# EAGLE design avoccado-nora-test-jig (EAGLE 7.2.0)
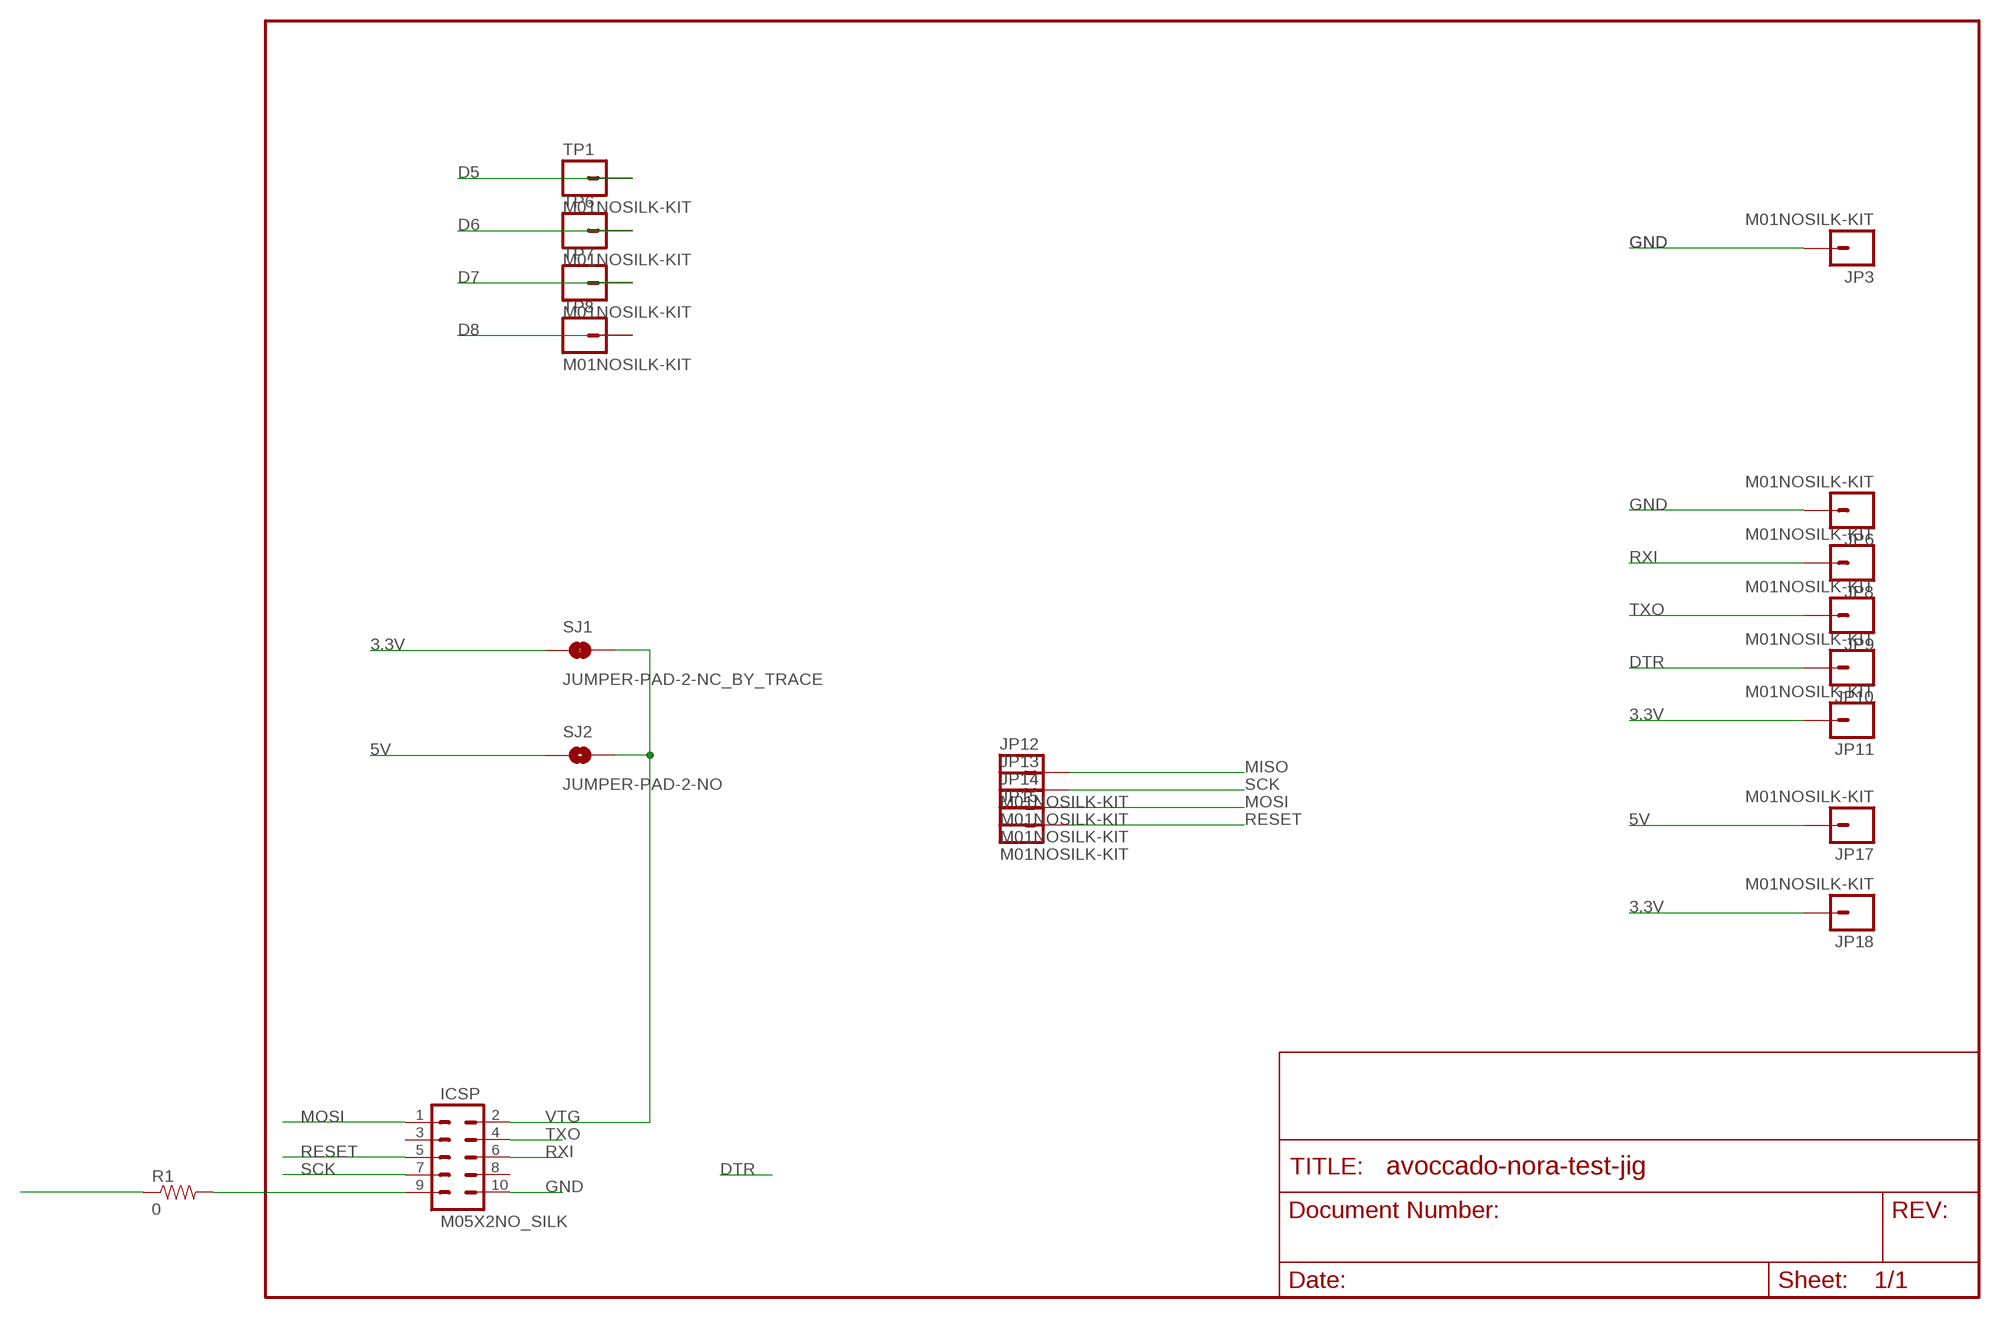
[diagram p0: schematic, sheet 1]

## Parts
ICSP  M05X2NO_SILK  [2X5_NOSILK]
JP3  M01NOSILK-KIT  [1X01NS-KIT]
JP6  M01NOSILK-KIT  [1X01NS-KIT]
JP8  M01NOSILK-KIT  [1X01NS-KIT]
JP9  M01NOSILK-KIT  [1X01NS-KIT]
JP10  M01NOSILK-KIT  [1X01NS-KIT]
JP11  M01NOSILK-KIT  [1X01NS-KIT]
JP12  M01NOSILK-KIT  [1X01NS-KIT]
JP13  M01NOSILK-KIT  [1X01NS-KIT]
JP14  M01NOSILK-KIT  [1X01NS-KIT]
JP15  M01NOSILK-KIT  [1X01NS-KIT]
JP17  M01NOSILK-KIT  [1X01NS-KIT]
JP18  M01NOSILK-KIT  [1X01NS-KIT]
R1  0  RESISTOR1206  [1206]
SJ1  JUMPER-PAD-2-NC_BY_TRACE  [PAD-JUMPER-2-NC_BY_TRACE_YES_SILK]
SJ2  JUMPER-PAD-2-NO  [PAD-JUMPER-2-NO_NO_SILK]
TP1  M01NOSILK-KIT  [1X01NS-KIT]
TP6  M01NOSILK-KIT  [1X01NS-KIT]
TP7  M01NOSILK-KIT  [1X01NS-KIT]
TP8  M01NOSILK-KIT  [1X01NS-KIT]

## Nets
3.3V: JP11.1 JP18.1 SJ1.1
5V: JP17.1 SJ2.1
D5: TP1.1
D6: TP6.1
D7: TP7.1
D8: TP8.1
DTR: JP10.1
GND [vcc]: ICSP.10 JP3.1 JP6.1
MISO: JP12.1 R1.1
MISO1: ICSP.9 R1.2
MOSI: ICSP.1 JP14.1
RESET: ICSP.5 JP15.1
RXI: ICSP.6 JP8.1
SCK: ICSP.7 JP13.1
TXO: ICSP.4 JP9.1
VTG: ICSP.2 SJ1.2 SJ2.2
Unconnected: ICSP.3 ICSP.8

## Library data of the parts
ICSP = SparkFun-Connectors:M05X2: Header 5x2 Standard 10-pin dual row 0.1" header. Commonly used with AVR-ISP. Use with Spark Fun Electronics SKU: PRT-00778
JP3 JP6 JP8-JP15 JP17 JP18 TP1 TP6-TP8 = SparkFun-Connectors:M01: Header 1 Standard 1-pin 0.1" header. Use with straight break away headers (SKU : PRT-00116), right angle break away headers (PRT-00553), swiss pins (PRT-00743), machine pins (PRT-00117), and female headers (PRT-00115).
R1 = SparkFun-Passives:RESISTOR: Resistor Basic schematic elements and footprints for 0603, 1206, and PTH resistors.
SJ1 = SparkFun-Passives:JUMPER-PAD-2-NC_BY_TRACE
SJ2 = SparkFun-Passives:JUMPER-PAD-2-NO

## Net classes
1 vcc: width 0.254 mm
3 usbvcc: width 0.203 mm, drill 0.61 mm, clearance 0.152 mm

## Board
Avoccado-avr-yolandi Yolandi is the minified version of Avoccado-avr with less pins broken out and a footprint of less than one square inch for the PCB without peripherals.
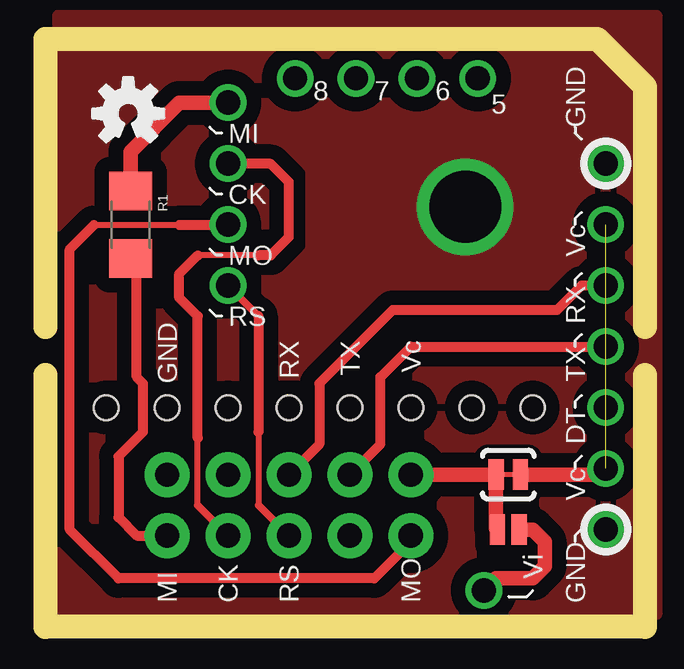
[diagram p1: board, top side]
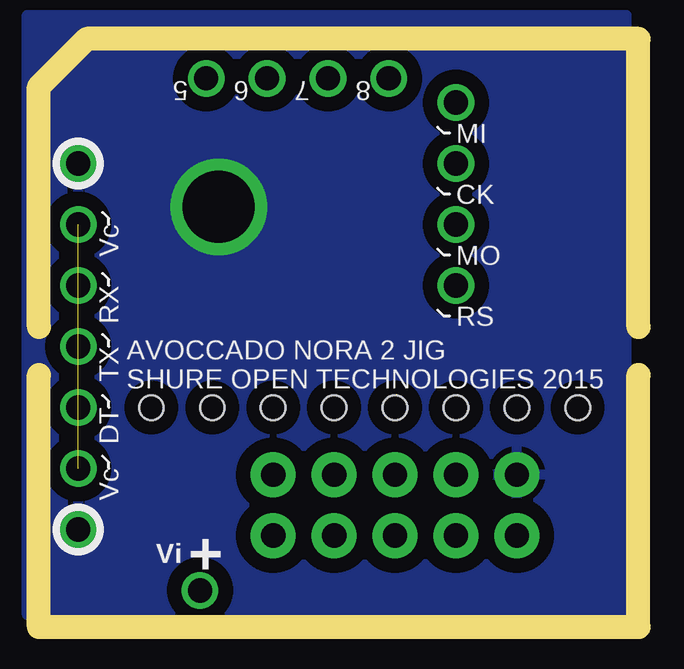
[diagram p2: board, bottom side, seen from below]

No outline drawn. Coordinates in mm, seen from the top.
Copper layers (1*16): Top 0.035mm / dielectric 1.5mm / Bottom 0.035mm
Design rules "dirt_cheap_dirty_boards.v1 *": minimum track width 5mil, minimum drill 12mil, track to track 5mil, track to pad 5mil, pad to pad 5mil, via to via 5mil, smd to smd 0mil, copper to edge 10mil, drill to drill 10mil, minimum pad ring 10mil, minimum via ring 6mil, stop-mask expansion 0mil, vias tented up to drill 25mil, thermal gap 10mil
Holes 1.02 mm at 4.57,8.64 7.11,8.64 9.65,8.64 12.19,8.64 14.73,8.64 17.27,8.64 19.81,8.64 2.03,8.64
tRestrict: area 3,3 to 14.7,7.1
Milling: 7 lines

### Footprints (pad centres in the part's own frame; a part is rotated, then mirrored left to right if it is on the bottom)
2X5_NOSILK = drill 1.016 pad 1.88: 1 -1.27,5.08; 2 1.27,5.08; 3 -1.27,2.54; 4 1.27,2.54; 5 -1.27,0; 6 1.27,0; 7 -1.27,-2.54; 8 1.27,-2.54; 9 -1.27,-5.08; 10 1.27,-5.08
1X01NS-KIT = drill 1.016 pad 1.524: 1 0,0
1206 = smd 1.6 x 1.8: 1 -1.4,0; 2 1.4,0
PAD-JUMPER-2-NC_BY_TRACE_YES_SILK = smd 0.635 x 1.27: 1 -0.508,0; 2 0.508,0
PAD-JUMPER-2-NO_NO_SILK = smd 0.635 x 1.27: 1 -0.45,0; 2 0.45,0

### Placement (x,y rotation side)
ICSP  9.65,4.57 90 bottom
JP3  22.86,18.8 0 top
JP6  22.86,3.56 0 top
JP8  22.86,13.72 0 top
JP9  22.86,11.18 0 top
JP10  22.86,8.64 0 top
JP11  22.86,16.26 0 top
JP12  7.11,21.34 0 top
JP13  7.11,18.8 0 top
JP14  7.11,16.26 0 top
JP15  7.11,13.72 0 top
JP17  17.78,1.02 0 top
JP18  22.86,6.1 0 top
LOGO2  OSHW-LOGOS  [OSHW-LOGO-S]  2.95,20.89 0 top
R1  3.05,16.26 270 top
SJ1  18.8,5.84 180 top
SJ2  18.8,3.56 180 top
TP1  17.53,22.36 270 top
TP6  14.99,22.36 270 top
TP7  12.45,22.36 270 top
TP8  9.91,22.36 270 top

### Tracks (layer width: path | path; a pad name or v marks a point on that pad's centre or on a via)
3.3V  (1 unrouted)
  Top 0.61: SJ1.1 22.6,5.84 JP18.1
5V
  Top 0.61: SJ2.1 19.81,3.56 20.32,3.05 20.32,2.03 19.81,1.52 18.28,1.52 JP17.1
GND  (via drill 3 pad 4)
  other vias: 17,17
  pour Bottom (isolate 0.61): 0.4,23.02 21,23 22.5,21.5 22.5,1 0.4,1
  pour Top (isolate 0.61): 0,0 0,25 25,25 25,0
  pour Top: 10.41,13.21 10.41,20.83 14.73,20.83 14.73,13.97 13.72,13.97 12.7,13.21
  pour Bottom (isolate 0.61): 25,0 25,25 0,25 0,0
MISO
  Top 0.61: R1.1 3.05,19.3 5.08,21.34 JP12.1
MISO1
  Top 0.305: 3.3,14.6 R1.2
  Top 0.406: ICSP.9 3.3,3.3 2.54,4.06 2.54,6.6 3.56,7.62 3.56,9.65 3.3,9.91 3.3,14.6
MOSI
  Top 0.254: 1.52,16.26 5.08,16.26
  Top 0.406: ICSP.1 14.73,3.05 13.21,1.52 2.54,1.52 0.51,3.56 0.51,15.24 1.52,16.26 | 5.08,16.26 JP14.1
RESET
  Top 0.254: 8.38,7.62 8.38,4.57
  Top 0.305: JP15.1 8.38,12.45 | 8.38,4.57 ICSP.5
  Top 0.406: 8.38,12.45 8.38,7.62
RXI  (1 unrouted)
  Top 0.406: JP8.1 21.84,13.72 20.83,12.7 13.97,12.7 10.92,9.65 10.92,7.11 ICSP.6
SCK
  Top 0.254: 5.84,4.57 5.84,7.37 | 8.38,14.99 5.84,14.99
  Top 0.305: 5.84,4.57 ICSP.7 | JP13.1
  Top 0.406: 5.84,14.99 5.08,14.22 5.08,13.21 5.84,12.45 5.84,7.37 | JP13.1 8.89,18.8 9.65,18.03 9.65,15.75 8.89,14.99 8.38,14.99
TXO
  Top 0.406: JP9.1 14.73,11.18 13.46,9.91 13.46,7.11 ICSP.4
VTG
  Top 0.61: SJ2.2 18.29,3.61 SJ1.2 ICSP.2

### Text on the board
tPlace: GND | 8 | 7 | 6 | 5 | MI | CK | Vc | MO | RX | GND | RS | RX | TX | Vc | TX | DT | Vc | Vi | GND | MI | CK | RS | MO
bPlace: 8 | 7 | 6 | 5 | MI | CK | Vc | MO | RX | RS | AVOCCADO NORA 2 JIG / SHURE OPEN TECHNOLOGIES 2015 | TX | DT | Vc | + | Vi
tRestrict: MI | CK | MO | R